# EAGLE design input (EAGLE 7.7.0)
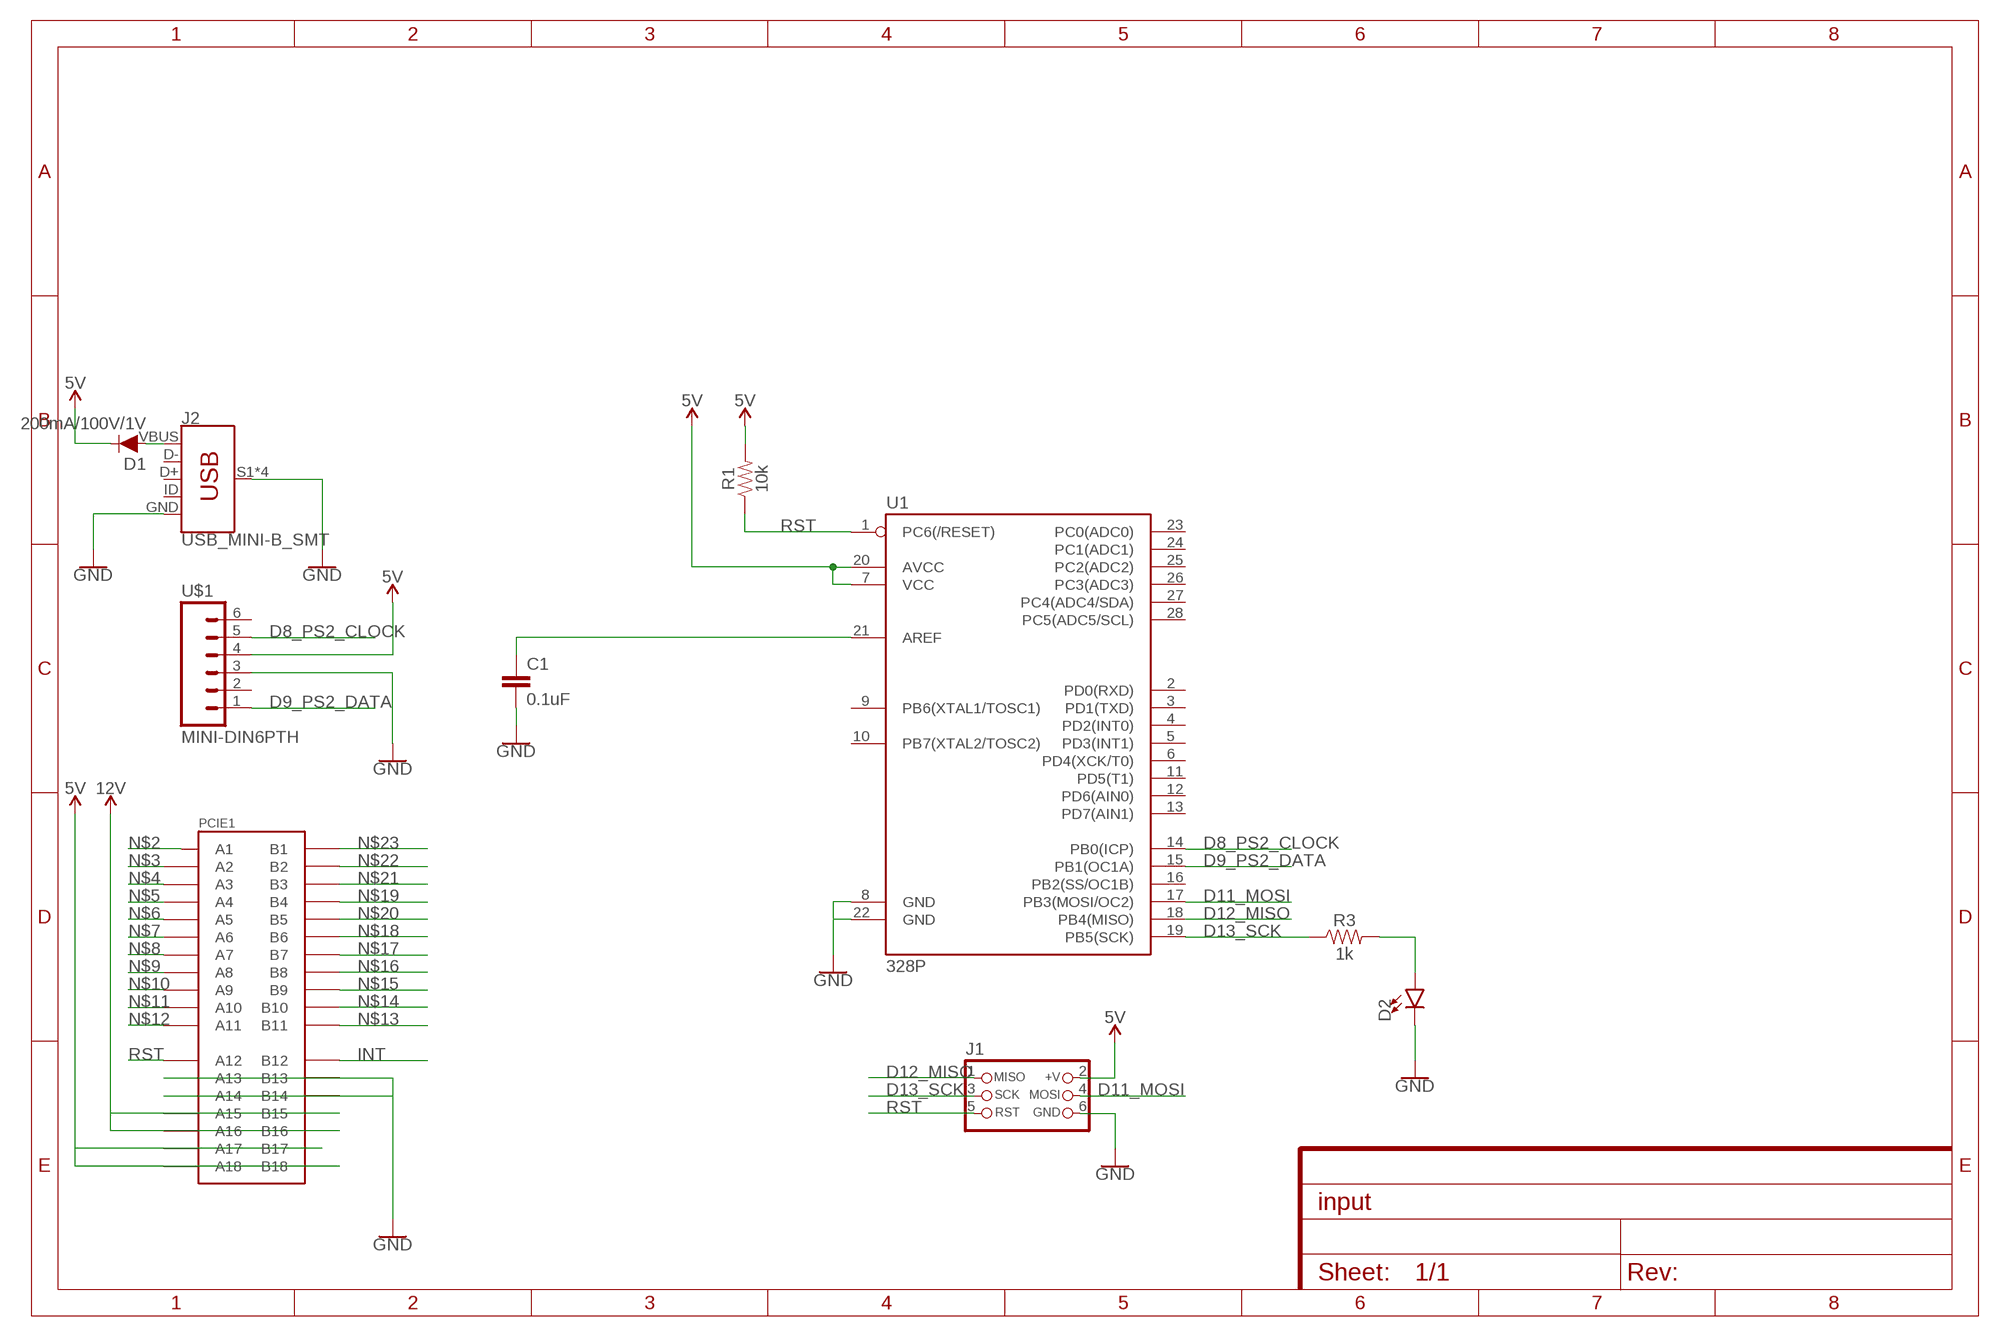
[diagram p0: schematic, sheet 1]

## Parts
C1  0.1uF  0.1UF-KIT-EZ-50V-20%  [CAP-PTH-SMALL-KIT]
D1  200mA/100V/1V  DIODE-1N4148  [DIODE-1N4148]
D2  LED5MM-KIT  [LED_5MM-KIT]
J1  CON_HEADER_PRG_AVR_ICSP-PTH  [HEADER_PRG_2X03]
J2  USB_MINI-B_SMT  [USB-MINIB]
PCIE1  PCIE-36-EDGE  [PCIE-36-EDGE]
R1  10k  10KOHM-HORIZ-1/4W-5%  [AXIAL-0.3]
R3  1k  1KOHM-HORIZ-1/4W-5%  [AXIAL-0.3]
U1  328P  ATMEGA328P_PDIP  [DIP28]
U$1  MINI-DIN6PTH  [MINI-DIN6]

## Nets
5V: D1.C J1.2(+V) PCIE1.A17 PCIE1.A18 PCIE1.B17 PCIE1.B18 R1.P$2 U1.7(VCC) U1.20(AVCC) U$1.4
12V: PCIE1.A15 PCIE1.A16 PCIE1.B15 PCIE1.B16
D8_PS2_CLOCK: U1.14(PB0(ICP)) U$1.5
D9_PS2_DATA: U1.15(PB1(OC1A)) U$1.1
D11_MOSI: J1.4(MOSI) U1.17(PB3(MOSI/OC2))
D12_MISO: J1.1(MISO) U1.18(PB4(MISO))
D13_SCK: J1.3(SCK) R3.P$1 U1.19(PB5(SCK))
GND: C1.2 D2.K(C) J1.6(GND) J2.GND J2.S1(SHIELD) J2.S2(SHIELD) J2.S3(SHIELD) J2.S4(SHIELD) PCIE1.A13 PCIE1.A14 PCIE1.B13 PCIE1.B14 U1.8(GND) U1.22(GND) U$1.3
INT: PCIE1.B12
N$1: D1.A J2.VBUS
N$2: PCIE1.A1
N$3: PCIE1.A2
N$4: PCIE1.A3
N$5: PCIE1.A4
N$6: PCIE1.A5
N$7: PCIE1.A6
N$8: PCIE1.A7
N$9: PCIE1.A8
N$10: PCIE1.A9
N$11: PCIE1.A10
N$12: PCIE1.A11
N$13: PCIE1.B11
N$14: PCIE1.B10
N$15: PCIE1.B9
N$16: PCIE1.B8
N$17: PCIE1.B7
N$18: PCIE1.B6
N$19: PCIE1.B4
N$20: PCIE1.B5
N$21: PCIE1.B3
N$22: PCIE1.B2
N$23: PCIE1.B1
N$24: C1.1 U1.21(AREF)
N$25: D2.A R3.P$2
RST: J1.5(RST) PCIE1.A12 R1.P$1 U1.1(PC6(/RESET))
Unconnected: J2.D+ J2.D- J2.ID U1.2(PD0(RXD)) U1.3(PD1(TXD)) U1.4(PD2(INT0)) U1.5(PD3(INT1)) U1.6(PD4(XCK/T0)) U1.9(PB6(XTAL1/TOSC1)) U1.10(PB7(XTAL2/TOSC2)) U1.11(PD5(T1)) U1.12(PD6(AIN0)) U1.13(PD7(AIN1)) U1.16(PB2(SS/OC1B)) U1.23(PC0(ADC0)) U1.24(PC1(ADC1)) U1.25(PC2(ADC2)) U1.26(PC3(ADC3)) U1.27(PC4(ADC4/SDA)) U1.28(PC5(ADC5/SCL)) U$1.2 U$1.6

## Library data of the parts
C1 = SparkFun-Capacitors:0.1UF: 0.1µF ceramic capacitors A capacitor is a passive two-terminal electrical component used to store electrical energy temporarily in an electric field.; PROD_ID: CAP-08370
D1 = SparkFun-DiscreteSemi:DIODE: Diode These are standard reverse protection diodes and small signal diodes. SparkFun Products: SparkFun SparkPunk Sound Kit <https://www.sparkfun.com/products/11177> SparkFun ESP8266 Thing <https://www.sparkfun.com/products/13231>; PROD_ID: DIO-08378
D2 = SparkFun-LED:LED: LED (Generic) Standard schematic elements and footprints for 5mm, 3mm, 1206, and 0603 sized LEDs. Generic LEDs with no color specified.
J1 = dp_devices:CON_HEADER_PRG_AVR_ICSP: 2x3 AVR ICSP programming header
J2 = SparkFun-Connectors:USB_MINI-B: USB type Mini-B Connector Breaks out 5th pin, and includes shield pins if needed. SparkFun Products: SparkFun FTDI Basic Breakout <https://www.sparkfun.com/products/9716> SparkFun XBee Explorer USB <https://www.sparkfun.com/products/11812> SparkFun Redboard <https://www.sparkfun.com/products/12757>; PROD_ID: CONN-08193; SF_ID: PRT-00587
PCIE1 = jt-con-pcie:PCIE-36-*: PCI-E 36-way connectors
R1 = SparkFun-Resistors:10KOHM: 10kΩ resistor A resistor is a passive two-terminal electrical component that implements electrical resistance as a circuit element. Resistors act to reduce current flow, and, at the same time, act to lower voltage levels within circuits. - Wikipedia; PROD_ID: RES-09435
R3 = SparkFun-Resistors:1KOHM: 1kΩ resistor A resistor is a passive two-terminal electrical component that implements electrical resistance as a circuit element. Resistors act to reduce current flow, and, at the same time, act to lower voltage levels within circuits. - Wikipedia; PROD_ID: RES-08380
U1 = SparkFun-IC-Microcontroller:ATMEGA328P_PDIP: Atmel 328P Through hole ATMEGA328P uC used in the Arduino 32kb flash, 1k EEPROM, 2k SRAM Datasheet <http://www.sparkfun.com/datasheets/Components/SMD/ATMega328.pdf> SparkFun Products Storefront component: AVR 28 Pin 20MHz 32K 6A/D - ATMega328P <https://www.sparkfun.com/products/9061> (COM-09061) SparkFun Simon Says - Through-Hole Soldering Kit <https://www.sparkfun.com/products/10547> (KIT-10547) SparkFun Learn to Solder - Simon Says <https://www.sparkfun.com/products/13708> (KIT-13708) SparkFun BigTime Watch Kit <https://www.sparkfun.com/products/11734> (KIT-11734) SparkFun ClockIt <https://www.sparkfun.com/products/10930> (KIT-10930) SparkFun Serial Enabled LCD Kit <https://www.sparkfun.com/products/10097> (LCD-10097) SparkFun Simon Tilts - Through Hole Soldering Kit <https://www.sparkfun.com/products/12634> (KIT-12634) SparkFun Frequency Counter Kit <https://www.sparkfun.com/products/10140> (KIT-10140) FabFM Radio Kit <https://www.sparkfun.com/products/11043> (KIT-11043) SparkFun Binary Blaster Kit <https://www.sparkfun.com/products/12037> (KIT-12037) SparkFun Metro-Gnome <https://www.sparkfun.com/products/9236> (KIT-09236) ATmega328 with Arduino Optiboot (Uno) <https://www.sparkfun.com/products/10524> (DEV-10524); PROD_ID: IC-09136
U$1 = SparkFun:MINI-DIN6: mini DIN 6 Connector Commonly found on the back of a computer for PS2 keyboard and mice. Schematic and footprint are proven. Spark Fun Electronics SKU : PRT-08509

## Board
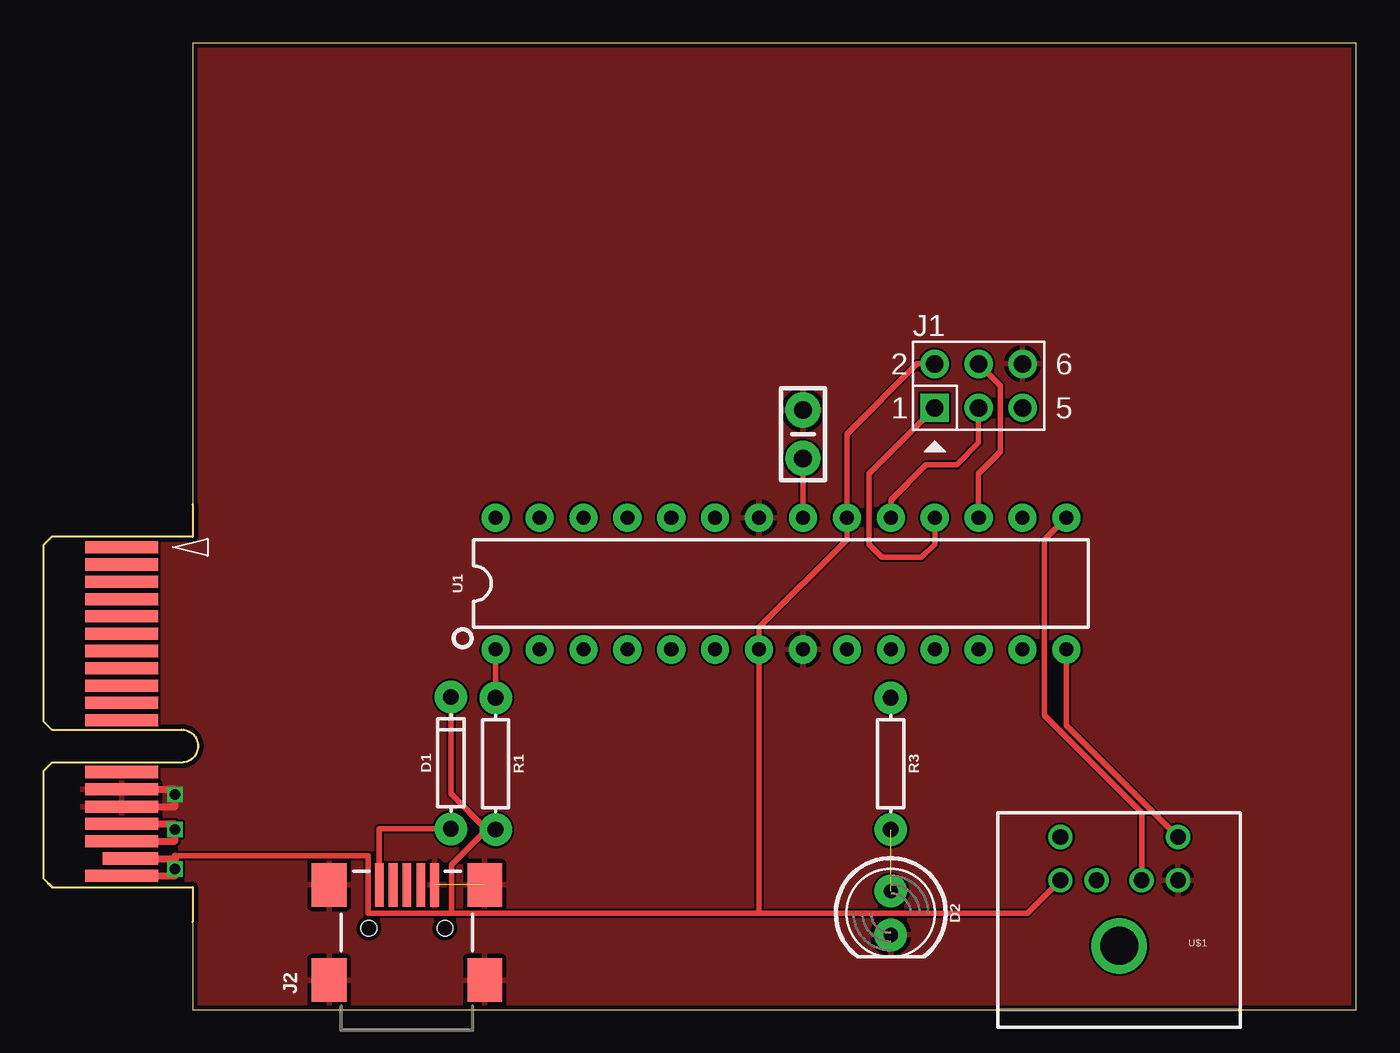
[diagram p1: board, top side]
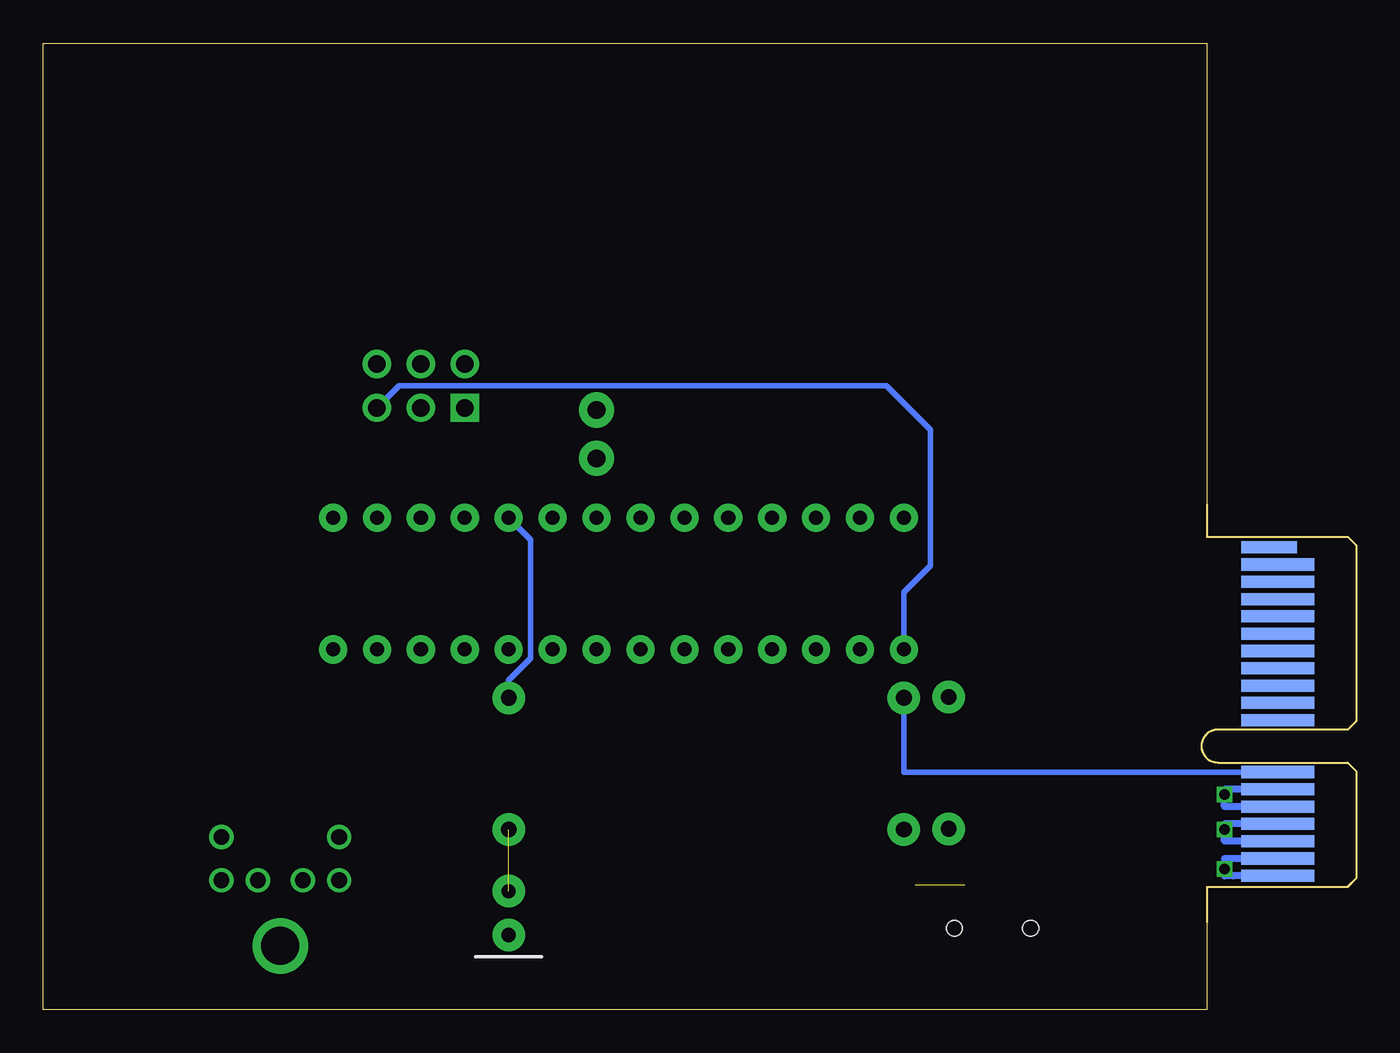
[diagram p2: board, bottom side, seen from below]

Size 75.95 x 55.88 mm. Coordinates in mm from the lower left corner, seen from the top.
Outline: 8.64,0 75.95,0 75.95,55.88 8.64,55.88 8.64,27.35 0.52,27.35 0,26.83 0,16.68 0.48,16.2 8,16.2 arc-180 8,14.29 0.49,14.29 0.01,13.81 0,7.62 0.55,7.1 8.64,7.1 8.64,0
Copper layers (1*16): Top 0.035mm / dielectric 1.5mm / Bottom 0.035mm
Design rules "dirtypcbs": minimum track width 5mil, minimum drill 12mil, track to track 5mil, track to pad 5mil, pad to pad 5mil, via to via 5mil, smd to smd 0mil, copper to edge 10mil, drill to drill 10mil, minimum pad ring 10mil, minimum via ring 6mil, stop-mask expansion 2mil, vias tented up to drill 25mil, thermal gap 10mil

### Footprints (pad centres in the part's own frame; a part is rotated, then mirrored left to right if it is on the bottom)
CAP-PTH-SMALL-KIT = drill 1.016 pad 2.032: 1 -1.397,0; 2 1.397,0
DIODE-1N4148 = drill 0.9 pad 1.88: A -3.81,0; C 3.81,0
LED_5MM-KIT = drill 0.813 pad 1.88: A -1.27,0; K 1.27,0
HEADER_PRG_2X03 = drill 1.02 pad 1.632 square: 1 -2.54,-1.27 | drill 1.02 pad 1.632: 2 -2.54,1.27; 3 0,-1.27; 4 0,1.27; 5 2.54,-1.27; 6 2.54,1.27
USB-MINIB = smd 2.5 x 0.5: D+ 2.5,0; D- 2.5,0.8; GND 2.5,-1.6; ID 2.5,-0.8; VBUS 2.5,1.6 | smd 2.5 x 2: S1 -3,4.5; S2 2.5,4.5; S3 -3,-4.5; S4 2.5,-4.5 | hole 0.9: 0,2.2; 0,-2.2
PCIE-36-EDGE = smd 0.7 x 3.2 bottom: A1 -11.5,-3.6 | smd 0.7 x 4.2 bottom: A2 -10.5,-4.1; A3 -9.5,-4.1; A4 -8.5,-4.1; A5 -7.5,-4.1; A6 -6.5,-4.1; A7 -5.5,-4.1; A8 -4.5,-4.1; A9 -3.5,-4.1; A10 -2.5,-4.1; A11 -1.5,-4.1; A12 1.5,-4.1; A13 2.5,-4.1; A14 3.5,-4.1; A15 4.5,-4.1; A16 5.5,-4.1; A17 6.5,-4.1; A18 7.5,-4.1 | smd 0.7 x 4.2: B1 -11.5,-4.1; B2 -10.5,-4.1; B3 -9.5,-4.1; B4 -8.5,-4.1; B5 -7.5,-4.1; B6 -6.5,-4.1; B7 -5.5,-4.1; B8 -4.5,-4.1; B9 -3.5,-4.1; B10 -2.5,-4.1; B11 -1.5,-4.1; B12 1.5,-4.1; B13 2.5,-4.1; B14 3.5,-4.1; B15 4.5,-4.1; B16 5.5,-4.1; B18 7.5,-4.1 | smd 0.7 x 3.2: B17 6.5,-3.6
AXIAL-0.3 = drill 0.9 pad 1.88: P$1 -3.81,0; P$2 3.81,0
DIP28 = drill 0.813 pad 1.626: 1 -16.51,-3.81; 2 -13.97,-3.81; 3 -11.43,-3.81; 4 -8.89,-3.81; 5 -6.35,-3.81; 6 -3.81,-3.81; 7 -1.27,-3.81; 8 1.27,-3.81; 9 3.81,-3.81; 10 6.35,-3.81; 11 8.89,-3.81; 12 11.43,-3.81; 13 13.97,-3.81; 14 16.51,-3.81; 15 16.51,3.81; 16 13.97,3.81; 17 11.43,3.81; 18 8.89,3.81; 19 6.35,3.81; 20 3.81,3.81; 21 1.27,3.81; 22 -1.27,3.81; 23 -3.81,3.81; 24 -6.35,3.81; 25 -8.89,3.81; 26 -11.43,3.81; 27 -13.97,3.81; 28 -16.51,3.81
MINI-DIN6 = drill 0.9: 1 -1.3,-8.5; 2 1.3,-8.5; 3 -3.4,-8.5; 4 3.4,-8.5; 5 -3.4,-11; 6 3.4,-11 | drill 2.2: P$1 0,-4.7

### Placement (x,y rotation side)
C1  43.95,33.27 90 top
D1  23.58,14.27 90 top
D2  49.03,5.59 270 top
J1  54.11,36.07 0 top
J2  21.04,4.71 90 top
PCIE1  8.64,15.24 270 top
R1  26.17,14.22 270 top
R3  49.03,14.22 270 top
U1  42.68,24.64 0 top
U$1  62.23,-1.02 180 top

### Tracks (layer width: path | path; a pad name or v marks a point on that pad's centre or on a via)
5V  (via drill 0.6)
  Top 0.305: 7.62,8.89 18.8,8.89 18.8,5.56 23.63,5.56 | 23.63,5.56 41.41,5.56 | 41.41,5.56 U1.7 41.41,22.1 46.49,27.18 U1.20 46.49,33.27 50.55,37.34 J1.2 | R1.P$2 25.66,10.41 | 25.66,10.41 23.63,8.38 23.63,5.56 | D1.C 23.58,12.49 25.66,10.41 | 41.41,5.56 56.91,5.56 U$1.4
  Top 0.406: PCIE1.B18 7.62,7.74 v7.62,8.13 7.62,8.74 | PCIE1.B17 7.62,8.74 | 7.62,8.74 7.62,8.89
  Bottom 0.406: PCIE1.A17 7.62,8.74 v7.62,8.13 | 7.12,7.74 PCIE1.B18 7.62,7.74 v7.62,8.13 | v7.62,8.13 7.62,8.38
12V  (via drill 0.6)
  Top 0.406: PCIE1.A15 7.62,10.74 7.62,10.67 v7.62,10.41 7.62,9.74 PCIE1.A16
  Bottom 0.406: PCIE1.A16 7.62,9.74 v7.62,10.41 7.62,10.74 PCIE1.A15
D8_PS2_CLOCK
  Top 0.305: U1.14 59.19,16.43 U$1.5
D9_PS2_DATA
  Top 0.305: U1.15 57.92,27.18 57.92,17.02 63.53,11.4 U$1.1
D11_MOSI
  Top 0.305: U1.17 54.11,30.99 55.38,32.26 55.38,36.07 J1.4
D12_MISO
  Top 0.305: U1.18 51.57,26.92 50.8,26.16 48.52,26.16 47.76,26.92 47.76,30.99 J1.1
D13_SCK
  Top 0.305: U1.19 49.03,29.46 51.06,31.5 52.84,31.5 54.11,32.77 J1.3
  Bottom 0.305: R3.P$1 49.03,19.05 47.76,20.32 47.76,27.18 U1.19
GND  (via drill 0.6)  (1 unrouted)
  Top 0.406: v7.62,12.45 7.62,12.7 | PCIE1.B13 7.62,12.74 v7.62,12.45 | PCIE1.B14 7.62,11.74 v7.62,12.45
  Bottom 0.406: PCIE1.B14 7.62,11.74 v7.62,12.45 7.62,12.74 PCIE1.B13
  pour Top: 2.29,0 75.95,0 75.95,55.88 2.29,55.88
N$1
  Top 0.305: J2.VBUS 19.44,10.46 D1.A
N$24
  Top 0.305: U1.21 C1.1
N$25  (1 unrouted)
RST
  Top 0.305: R1.P$1 U1.1
  Bottom 0.305: PCIE1.A12 26.17,13.74 R1.P$1 | U1.1 26.17,24.13 24.64,25.65 24.64,33.53 27.18,36.07 55.38,36.07 J1.5